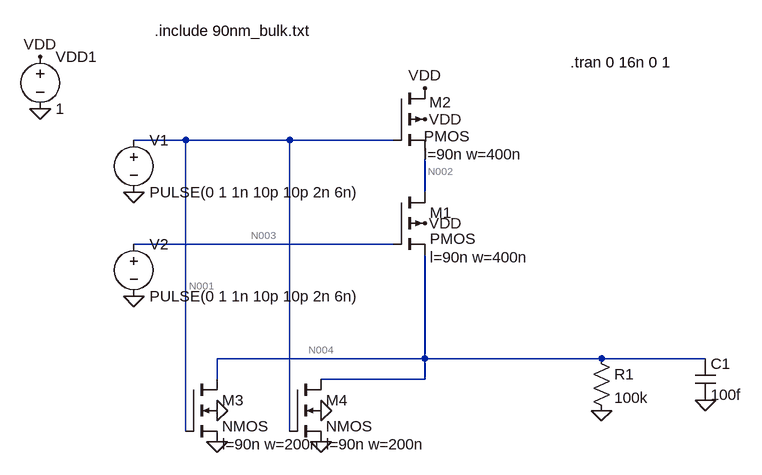
[diagram p0: schematic Draft1.asc]
Draft1.asc, the LTspice schematic file:
Version 4
SHEET 1 992 680
WIRE -240 192 -320 192
WIRE -80 192 -240 192
WIRE 80 192 -80 192
WIRE 128 272 128 208
WIRE 80 352 -320 352
WIRE 128 528 128 368
WIRE 128 528 -192 528
WIRE 400 528 128 528
WIRE 560 528 400 528
WIRE -192 560 -192 528
WIRE 128 560 128 528
WIRE 128 560 -32 560
WIRE -240 640 -240 192
WIRE -80 640 -80 192
FLAG -320 272 0
FLAG 400 608 0
FLAG 560 592 0
FLAG 128 112 VDD
FLAG 128 160 VDD
FLAG -464 64 VDD
FLAG -464 144 0
FLAG -320 432 0
FLAG -192 656 0
FLAG -32 656 0
FLAG -32 608 0
FLAG -192 608 0
FLAG 128 320 VDD
SYMBOL pmos4 80 112 R0
WINDOW 0 55 22 Left 2
WINDOW 3 47 74 Left 2
WINDOW 123 47 102 Left 2
SYMATTR InstName M2
SYMATTR Value2 l=90n w=400n
SYMBOL voltage -320 176 R0
WINDOW 123 0 0 Left 0
WINDOW 39 0 0 Left 0
SYMATTR InstName V1
SYMATTR Value PULSE(0 1 1n 10p 10p 2n 6n)
SYMBOL res 384 512 R0
SYMATTR InstName R1
SYMATTR Value 100k
SYMBOL cap 544 528 R0
SYMATTR InstName C1
SYMATTR Value 100f
SYMBOL voltage -464 48 R0
WINDOW 123 0 0 Left 0
WINDOW 39 0 0 Left 0
SYMATTR InstName VDD1
SYMATTR Value 1
SYMBOL voltage -320 336 R0
WINDOW 123 0 0 Left 0
WINDOW 39 0 0 Left 0
SYMATTR InstName V2
SYMATTR Value PULSE(0 1 1n 10p 10p 2n 6n)
SYMBOL pmos4 80 272 R0
WINDOW 123 56 100 Left 2
SYMATTR Value2 l=90n w=400n
SYMATTR InstName M1
SYMBOL nmos4 -240 560 R0
WINDOW 123 56 100 Left 2
SYMATTR Value2 l=90n w=200n
SYMATTR InstName M3
SYMBOL nmos4 -80 560 R0
WINDOW 123 56 100 Left 2
SYMATTR Value2 l=90n w=200n
SYMATTR InstName M4
TEXT -288 24 Left 2 !.include 90nm_bulk.txt
TEXT 352 72 Left 2 !.tran 0 16n 0 1

The netlist it stands for:
* Draft1.asc
M2 VDD N001 N002 VDD PMOS l=90n w=400n
V1 N001 0 PULSE(0 1 1n 10p 10p 2n 6n)
R1 N004 0 100k
C1 N004 0 100f
VDD1 VDD 0 1
V2 N003 0 PULSE(0 1 1n 10p 10p 2n 6n)
M1 N002 N003 N004 VDD PMOS l=90n w=400n
M3 N004 N001 0 0 NMOS l=90n w=200n
M4 N004 N001 0 0 NMOS l=90n w=200n
.model NMOS NMOS
.model PMOS PMOS
.lib standard.mos
.include 90nm_bulk.txt
.tran 0 16n 0 1
.backanno
.end

* Results of the author's LTspice run, read from the files saved beside the schematic
* Operating Point, zero values left out:
*   V(vdd) = 1 V
*   V(n002) = 973.3 mV
*   V(n004) = 945.6 mV
*   Id(M4) = 4.544 nA
*   Ig(M4) = -90.77 pA
*   Is(M4) = -4.452 nA
*   Id(M3) = 4.544 nA
*   Ig(M3) = -90.77 pA
*   Is(M3) = -4.452 nA
*   Id(M1) = 9.465 µA
*   Ig(M1) = -2.383 pA
*   Is(M1) = -9.465 µA
*   Id(M2) = 9.465 µA
*   Ig(M2) = -2.743 pA
*   Is(M2) = -9.465 µA
*   I(R1) = 9.456 µA
*   I(V2) = 2.383 pA
*   I(Vdd1) = -9.465 µA
*   I(V1) = 184.3 pA
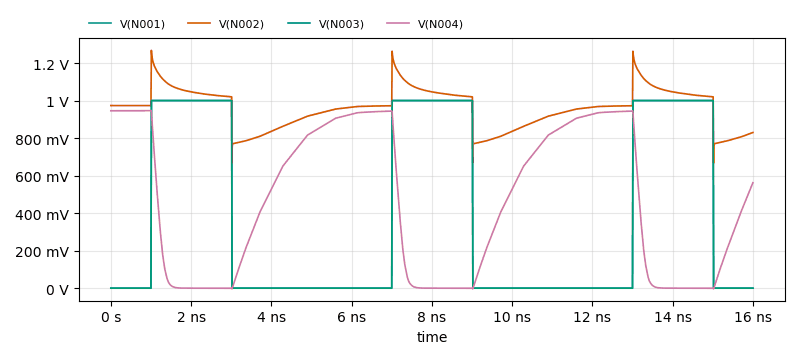
[diagram p1: Transient Analysis of Draft1.asc, plotted from the saved traces]
* Transient Analysis, 1 run:
*   V(N001): min 0 V, max 1 V, average 376.9 mV, rms 613.4 mV, last 0 V
*   V(N002): min 667.1 mV, max 1.267 V, average 959.6 mV, rms 965.3 mV, last 829.6 mV
*   V(N003): min 0 V, max 1 V, average 376.9 mV, rms 613.4 mV, last 0 V
*   V(N004): min -3.328 mV, max 947.5 mV, average 460.3 mV, rms 606.5 mV, last 561.9 mV